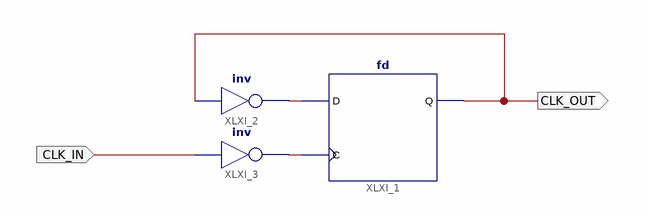
[diagram p0: schematic sheet 1]
// Xilinx ISE schematic diviser_2.sch (spartan6) as structural Verilog: 3 symbols, 2 ports
module diviser_2 (
  input  CLK_IN,
  output CLK_OUT
);

  wire XLXN_5, XLXN_6;

  fd XLXI_1 (.C(XLXN_6), .D(XLXN_5), .Q(CLK_OUT));
  not XLXI_2 (XLXN_5, CLK_OUT);
  not XLXI_3 (XLXN_6, CLK_IN);
endmodule
